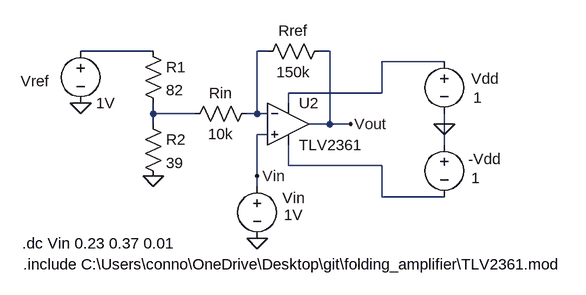
[diagram p0: schematic level_shifter_testing.asc]
level_shifter_testing.asc, the LTspice schematic file:
Version 4
SHEET 1 1216 680
WIRE 176 -64 64 -64
WIRE 352 -64 336 -64
WIRE 448 -64 432 -64
WIRE 624 -48 528 -48
WIRE 528 0 528 -48
WIRE 528 0 384 0
WIRE 384 16 384 0
WIRE 176 32 176 16
WIRE 240 32 176 32
WIRE 336 32 336 -64
WIRE 336 32 320 32
WIRE 352 32 336 32
WIRE 176 48 176 32
WIRE 448 48 448 -64
WIRE 448 48 416 48
WIRE 480 48 448 48
WIRE 624 48 624 32
WIRE 352 64 336 64
WIRE 624 80 624 48
WIRE 384 112 384 80
WIRE 528 112 384 112
WIRE 336 128 336 64
WIRE 336 144 336 128
WIRE 528 160 528 112
WIRE 624 160 528 160
FLAG 480 48 Vout
FLAG 336 224 0
FLAG 624 48 0
FLAG 336 128 Vin
FLAG 176 128 0
FLAG 64 16 0
SYMBOL res 448 -80 R90
WINDOW 0 0 56 VBottom 2
WINDOW 3 32 56 VTop 2
SYMATTR InstName Rref
SYMATTR Value 150k
SYMBOL res 336 16 R90
WINDOW 0 0 56 VBottom 2
WINDOW 3 32 56 VTop 2
SYMATTR InstName Rin
SYMATTR Value 10k
SYMBOL voltage 336 128 R0
WINDOW 0 39 34 Left 2
WINDOW 3 41 60 Left 2
WINDOW 123 0 0 Left 0
WINDOW 39 0 0 Left 0
SYMATTR InstName Vin
SYMATTR Value 1V
SYMBOL voltage 624 -64 R0
WINDOW 0 42 42 Left 2
WINDOW 3 45 71 Left 2
WINDOW 123 0 0 Left 0
WINDOW 39 0 0 Left 0
SYMATTR InstName Vdd
SYMATTR Value 1
SYMBOL voltage 624 64 R0
WINDOW 0 37 38 Left 2
WINDOW 3 42 67 Left 2
WINDOW 123 0 0 Left 0
WINDOW 39 0 0 Left 0
SYMATTR InstName -Vdd
SYMATTR Value 1
SYMBOL res 160 -80 R0
SYMATTR InstName R1
SYMATTR Value 82
SYMBOL res 160 32 R0
SYMATTR InstName R2
SYMATTR Value 39
SYMBOL voltage 64 -80 R0
WINDOW 0 -92 62 Left 2
WINDOW 123 0 0 Left 0
WINDOW 39 0 0 Left 0
SYMATTR InstName Vref
SYMATTR Value 1V
SYMBOL Opamps\\opamp2 384 -16 R0
SYMATTR InstName U2
SYMATTR Value TLV2361
TEXT -26 232 Left 2 !.dc Vin 0.23 0.37 0.01
TEXT -24 264 Left 2 !.include C:\\Users\\conno\\OneDrive\\Desktop\\git\\folding_amplifier\\TLV2361.mod

The netlist it stands for:
* level_shifter_testing.asc
Rref Vout N002 150k
Rin N002 N004 10k
Vin Vin 0 1V
Vdd N003 0 1
V§-Vdd 0 N005 1
R1 N001 N004 82
R2 N004 0 39
Vref N001 0 1V
XU2 Vin N002 N003 N005 Vout TLV2361  ; pins In+ In- V+ V- OUT
.dc Vin 0.23 0.37 0.01
.include C:\Users\conno\OneDrive\Desktop\git\folding_amplifier\TLV2361.mod
.backanno
.end